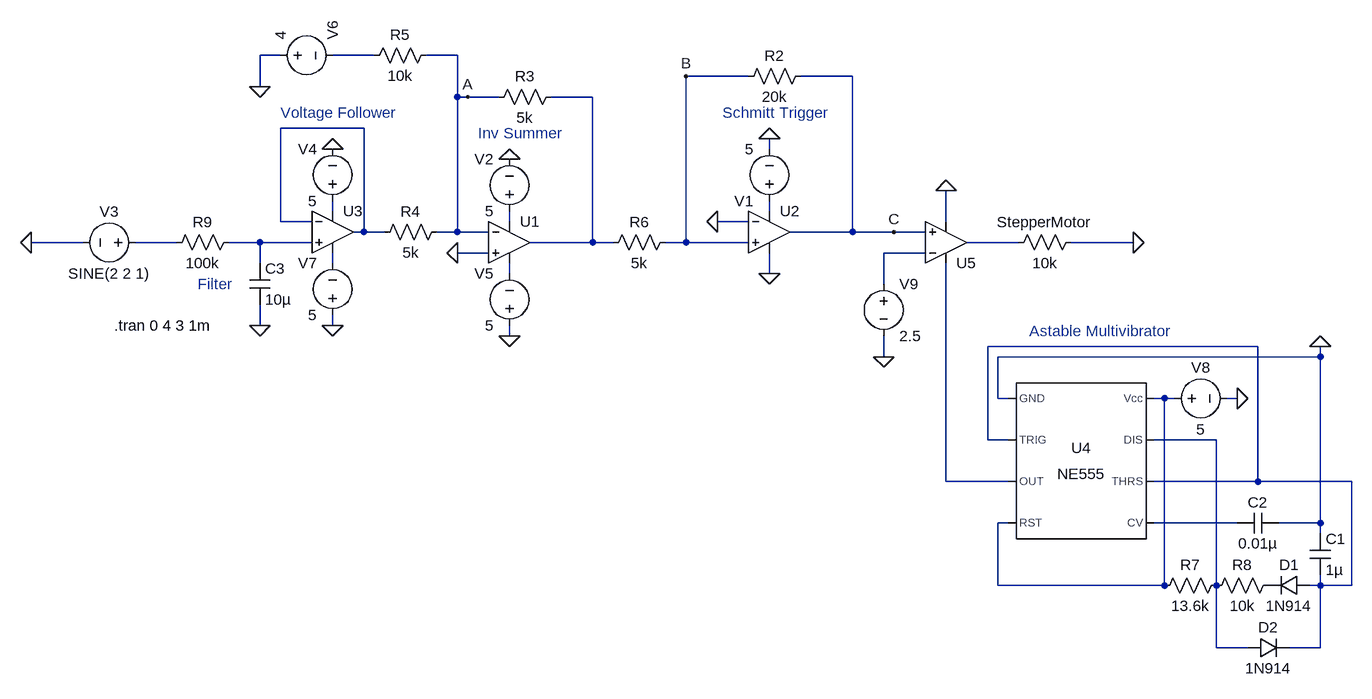
[diagram p0: schematic StepperMotorCircuit.asc]
StepperMotorCircuit.asc, the LTspice schematic file:
Version 4
SHEET 1 1224 680
WIRE -496 -368 -528 -368
WIRE -352 -368 -416 -368
WIRE -224 -368 -272 -368
WIRE 224 -336 128 -336
WIRE 384 -336 304 -336
WIRE -528 -320 -528 -368
WIRE -224 -304 -224 -368
WIRE -208 -304 -224 -304
WIRE -160 -304 -208 -304
WIRE -16 -304 -80 -304
WIRE -368 -256 -496 -256
WIRE 256 -224 256 -240
WIRE -416 -128 -416 -144
WIRE 256 -128 256 -144
WIRE -496 -112 -496 -256
WIRE -448 -112 -496 -112
WIRE -144 -112 -144 -128
WIRE 224 -112 176 -112
WIRE 528 -112 528 -160
WIRE -368 -96 -368 -256
WIRE -368 -96 -384 -96
WIRE -336 -96 -368 -96
WIRE -224 -96 -224 -304
WIRE -224 -96 -256 -96
WIRE -176 -96 -224 -96
WIRE 384 -96 384 -336
WIRE 384 -96 288 -96
WIRE 448 -96 384 -96
WIRE 496 -96 448 -96
WIRE -800 -80 -880 -80
WIRE -656 -80 -720 -80
WIRE -528 -80 -576 -80
WIRE -448 -80 -528 -80
WIRE -16 -80 -16 -304
WIRE -16 -80 -112 -80
WIRE 16 -80 -16 -80
WIRE 128 -80 128 -336
WIRE 128 -80 96 -80
WIRE 224 -80 128 -80
WIRE 640 -80 560 -80
WIRE 816 -80 720 -80
WIRE -176 -64 -224 -64
WIRE 496 -64 432 -64
WIRE -528 -48 -528 -80
WIRE -416 -48 -416 -64
WIRE -144 -32 -144 -48
WIRE 256 -32 256 -64
WIRE 432 -16 432 -64
WIRE -528 48 -528 16
WIRE -416 48 -416 32
WIRE -144 64 -144 48
WIRE 1008 80 592 80
WIRE 432 96 432 64
WIRE 1104 96 1104 80
WIRE 1104 96 608 96
WIRE 608 160 608 96
WIRE 624 160 608 160
WIRE 864 160 848 160
WIRE 880 160 864 160
WIRE 976 160 960 160
WIRE 592 224 592 80
WIRE 624 224 592 224
WIRE 944 224 848 224
WIRE 528 288 528 -48
WIRE 624 288 528 288
WIRE 1008 288 1008 80
WIRE 1008 288 848 288
WIRE 1152 288 1008 288
WIRE 624 352 608 352
WIRE 976 352 848 352
WIRE 1104 352 1104 96
WIRE 1104 352 1040 352
WIRE 1104 368 1104 352
WIRE 608 448 608 352
WIRE 864 448 864 160
WIRE 864 448 608 448
WIRE 944 448 944 224
WIRE 1104 448 1104 432
WIRE 1104 448 1088 448
WIRE 1152 448 1152 288
WIRE 1152 448 1104 448
WIRE 944 544 944 448
WIRE 992 544 944 544
WIRE 1104 544 1104 448
WIRE 1104 544 1056 544
FLAG 256 -240 0
FLAG 256 -32 0
FLAG -880 -80 0
FLAG -416 -224 0
FLAG -416 48 0
FLAG 176 -112 0
FLAG -144 -208 0
FLAG -144 64 0
FLAG -528 -320 0
FLAG -224 -64 0
FLAG -208 -304 A
FLAG 128 -336 B
FLAG 448 -96 C
FLAG 976 160 0
FLAG 1104 80 0
FLAG 816 -80 0
FLAG 432 96 0
FLAG 528 -160 0
FLAG -528 48 0
SYMBOL res 320 -352 R90
WINDOW 0 0 56 VBottom 2
WINDOW 3 32 56 VTop 2
SYMATTR InstName R2
SYMATTR Value 20k
SYMBOL voltage 256 -128 R180
WINDOW 123 0 0 Left 0
WINDOW 39 0 0 Left 0
SYMATTR InstName V1
SYMATTR Value 5
SYMBOL voltage -704 -80 R90
WINDOW 0 -32 56 VBottom 2
WINDOW 3 32 56 VTop 2
WINDOW 123 0 0 Left 0
WINDOW 39 0 0 Left 0
SYMATTR InstName V3
SYMATTR Value SINE(2 2 1)
SYMBOL OpAmps\\UniversalOpamp2 256 -96 R0
SYMATTR InstName U2
SYMBOL OpAmps\\UniversalOpamp2 -416 -96 R0
SYMATTR InstName U3
SYMBOL voltage -416 -128 R180
WINDOW 0 24 96 Left 2
WINDOW 3 24 16 Left 2
SYMATTR InstName V4
SYMATTR Value 5
SYMBOL voltage -416 48 R180
WINDOW 0 24 96 Left 2
WINDOW 3 24 16 Left 2
SYMATTR InstName V7
SYMATTR Value 5
SYMBOL OpAmps\\UniversalOpamp2 -144 -80 R0
SYMATTR InstName U1
SYMBOL voltage -144 -112 R180
WINDOW 0 24 96 Left 2
WINDOW 3 24 16 Left 2
WINDOW 123 0 0 Left 0
WINDOW 39 0 0 Left 0
SYMATTR InstName V2
SYMATTR Value 5
SYMBOL voltage -144 64 R180
WINDOW 0 24 96 Left 2
WINDOW 3 24 16 Left 2
SYMATTR InstName V5
SYMATTR Value 5
SYMBOL res -240 -112 R90
WINDOW 0 0 56 VBottom 2
WINDOW 3 32 56 VTop 2
SYMATTR InstName R4
SYMATTR Value 5k
SYMBOL res -64 -320 R90
WINDOW 0 0 56 VBottom 2
WINDOW 3 32 56 VTop 2
SYMATTR InstName R3
SYMATTR Value 5k
SYMBOL res -256 -384 R90
WINDOW 0 0 56 VBottom 2
WINDOW 3 32 56 VTop 2
SYMATTR InstName R5
SYMATTR Value 10k
SYMBOL voltage -512 -368 R270
WINDOW 0 24 96 Left 2
WINDOW 3 24 16 Left 2
WINDOW 123 0 0 Left 0
WINDOW 39 0 0 Left 0
SYMATTR InstName V6
SYMATTR Value 4
SYMBOL res 112 -96 R90
WINDOW 0 0 56 VBottom 2
WINDOW 3 32 56 VTop 2
SYMATTR InstName R6
SYMATTR Value 5k
SYMBOL Misc\\NE555 736 256 R0
SYMATTR InstName U4
SYMBOL voltage 864 160 R270
WINDOW 0 32 56 VTop 2
WINDOW 3 -32 56 VBottom 2
SYMATTR InstName V8
SYMATTR Value 5
SYMBOL res 960 432 R90
WINDOW 0 0 56 VBottom 2
WINDOW 3 32 56 VTop 2
SYMATTR InstName R7
SYMATTR Value 13.6k
SYMBOL res 1040 432 R90
WINDOW 0 0 56 VBottom 2
WINDOW 3 32 56 VTop 2
SYMATTR InstName R8
SYMATTR Value 10k
SYMBOL diode 1088 432 R90
WINDOW 0 0 32 VBottom 2
WINDOW 3 32 32 VTop 2
SYMATTR InstName D1
SYMATTR Value 1N914
SYMBOL diode 992 560 R270
WINDOW 0 32 32 VTop 2
WINDOW 3 0 32 VBottom 2
SYMATTR InstName D2
SYMATTR Value 1N914
SYMBOL cap 1088 368 R0
SYMATTR InstName C1
SYMATTR Value 1µ
SYMBOL cap 1040 336 R90
WINDOW 0 0 32 VBottom 2
WINDOW 3 32 32 VTop 2
SYMATTR InstName C2
SYMATTR Value 0.01µ
SYMBOL OpAmps\\UniversalOpamp2 528 -80 M180
SYMATTR InstName U5
SYMBOL voltage 432 -32 R0
WINDOW 123 0 0 Left 0
WINDOW 39 0 0 Left 0
SYMATTR InstName V9
SYMATTR Value 2.5
SYMBOL res 624 -64 R270
WINDOW 0 32 56 VTop 2
WINDOW 3 0 56 VBottom 2
SYMATTR InstName StepperMotor
SYMATTR Value 10k
SYMBOL res -560 -96 R90
WINDOW 0 0 56 VBottom 2
WINDOW 3 32 56 VTop 2
SYMATTR InstName R9
SYMATTR Value 100k
SYMBOL cap -544 -48 R0
SYMATTR InstName C3
SYMATTR Value 10µ
TEXT -752 48 Left 2 !.tran 0 4 3 1m
TEXT -496 -280 Left 2 ;Voltage Follower
TEXT -192 -248 Left 2 ;Inv Summer
TEXT 184 -280 Left 2 ;Schmitt Trigger
TEXT -624 -16 Left 2 ;Filter
TEXT 656 56 Left 2 ;Astable Multivibrator

The netlist it stands for:
* StepperMotorCircuit.asc
R2 C B 20k
V1 N005 0 5
V3 N007 0 SINE(2 2 1)
XU2 B 0 N005 0 C level.2 Avol=1Meg GBW=10Meg Slew=10Meg ilimit=25m rail=0 Vos=0 phimargin=45 en=0 enk=0 in=0 ink=0 Rin=500Meg  ; pins IN+ IN- V+ V- OUT
XU3 N008 N003 N004 N011 N003 level.2 Avol=1Meg GBW=10Meg Slew=10Meg ilimit=25m rail=0 Vos=0 phimargin=45 en=0 enk=0 in=0 ink=0 Rin=500Meg  ; pins IN+ IN- V+ V- OUT
V4 N004 0 5
V7 0 N011 5
XU1 0 A N006 N012 N002 level.2 Avol=1Meg GBW=10Meg Slew=10Meg ilimit=25m rail=0 Vos=0 phimargin=45 en=0 enk=0 in=0 ink=0 Rin=500Meg  ; pins IN+ IN- V+ V- OUT
V2 N006 0 5
V5 0 N012 5
R4 A N003 5k
R3 N002 A 5k
R5 A N001 10k
V6 0 N001 4
R6 B N002 5k
XU4 0 N013 N016 N014 N017 N013 N015 N014 NE555  ; pins GND TRIG OUT RST CV THRS DIS Vcc
V8 N014 0 5
R7 N015 N014 13.6k
R8 P001 N015 10k
D1 N013 P001 1N914
D2 N015 N013 1N914
C1 0 N013 1µ
C2 0 N017 0.01µ
XU5 C N010 N016 0 N009 level.2 Avol=1Meg GBW=10Meg Slew=10Meg ilimit=25m rail=0 Vos=0 phimargin=45 en=0 enk=0 in=0 ink=0 Rin=500Meg  ; pins IN+ IN- V+ V- OUT
V9 N010 0 2.5
R§StepperMotor N009 0 10k
R9 N008 N007 100k
C3 N008 0 10µ
.model D D
.lib standard.dio
.tran 0 4 3 1m
* Voltage Follower
* Inv Summer
* Schmitt Trigger
* Filter
* Astable Multivibrator
.lib UniversalOpamps2.sub
.lib NE555.sub
.backanno
.end